# EAGLE design manvnode (EAGLE 5.09)
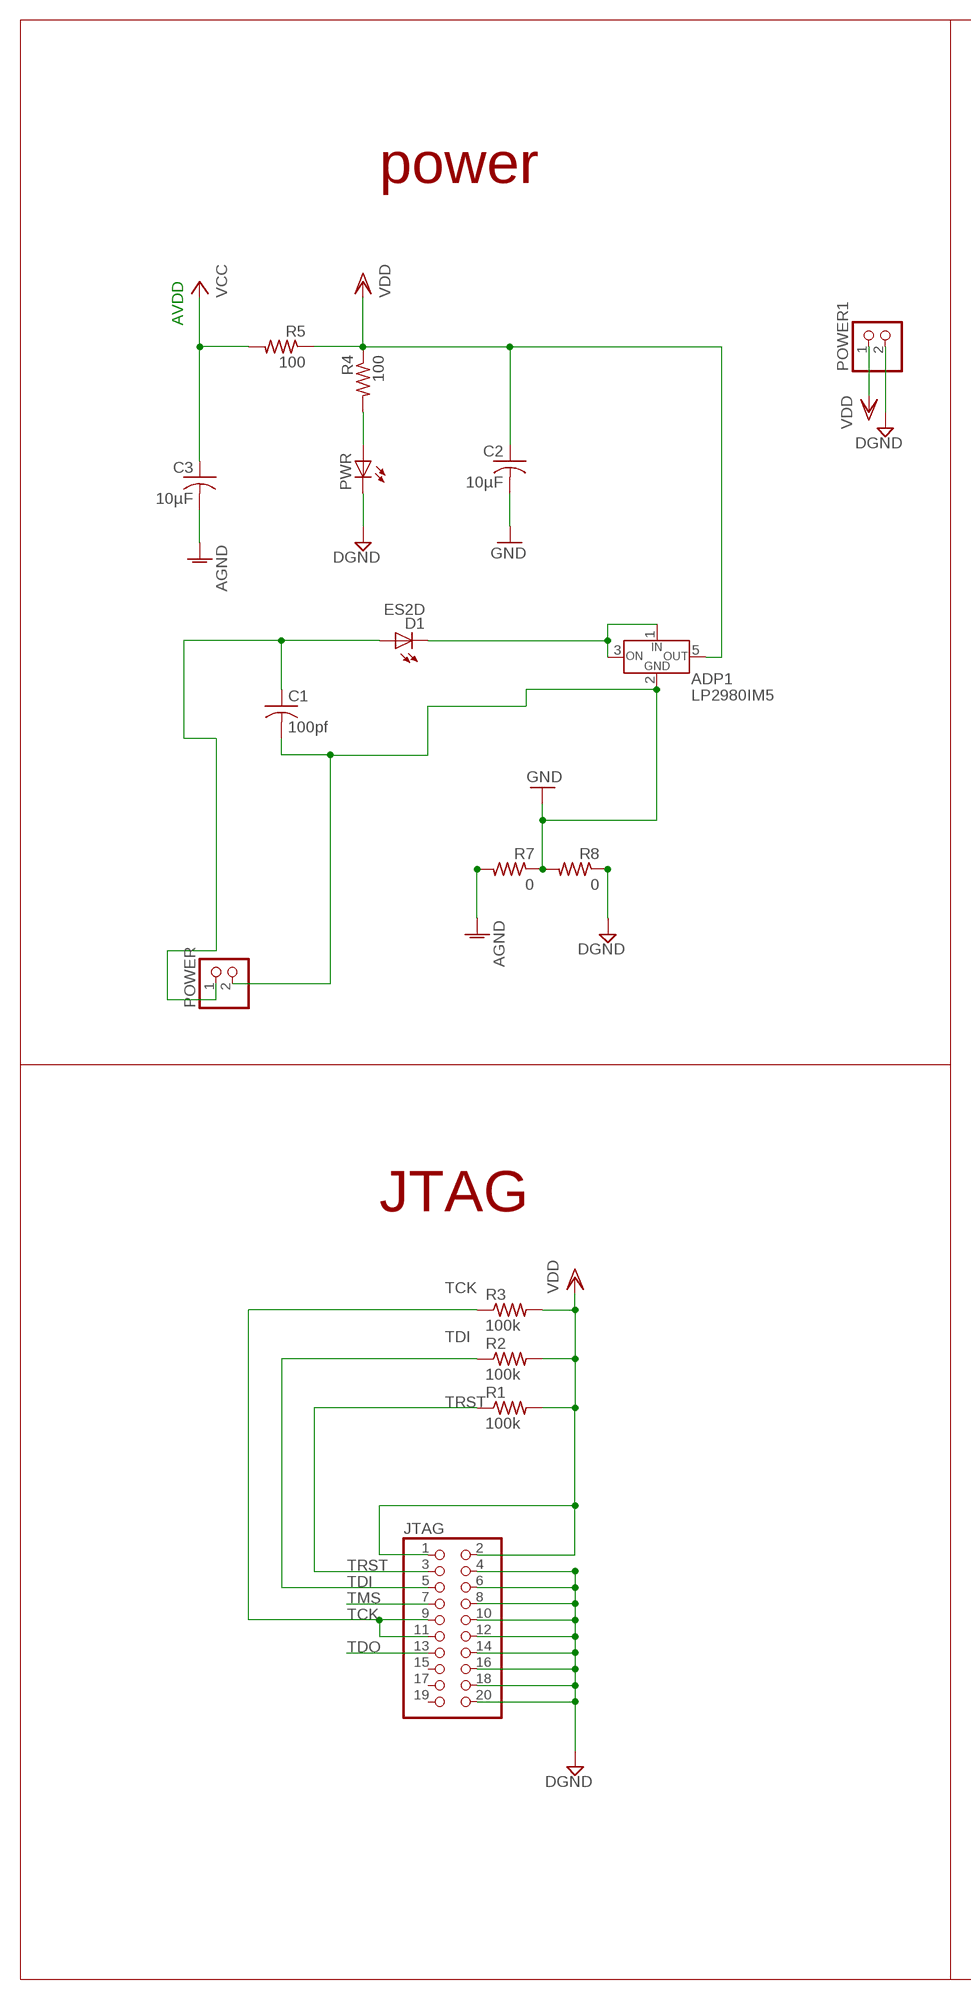
[diagram p0: schematic, sheet 1, part 1 of 2]
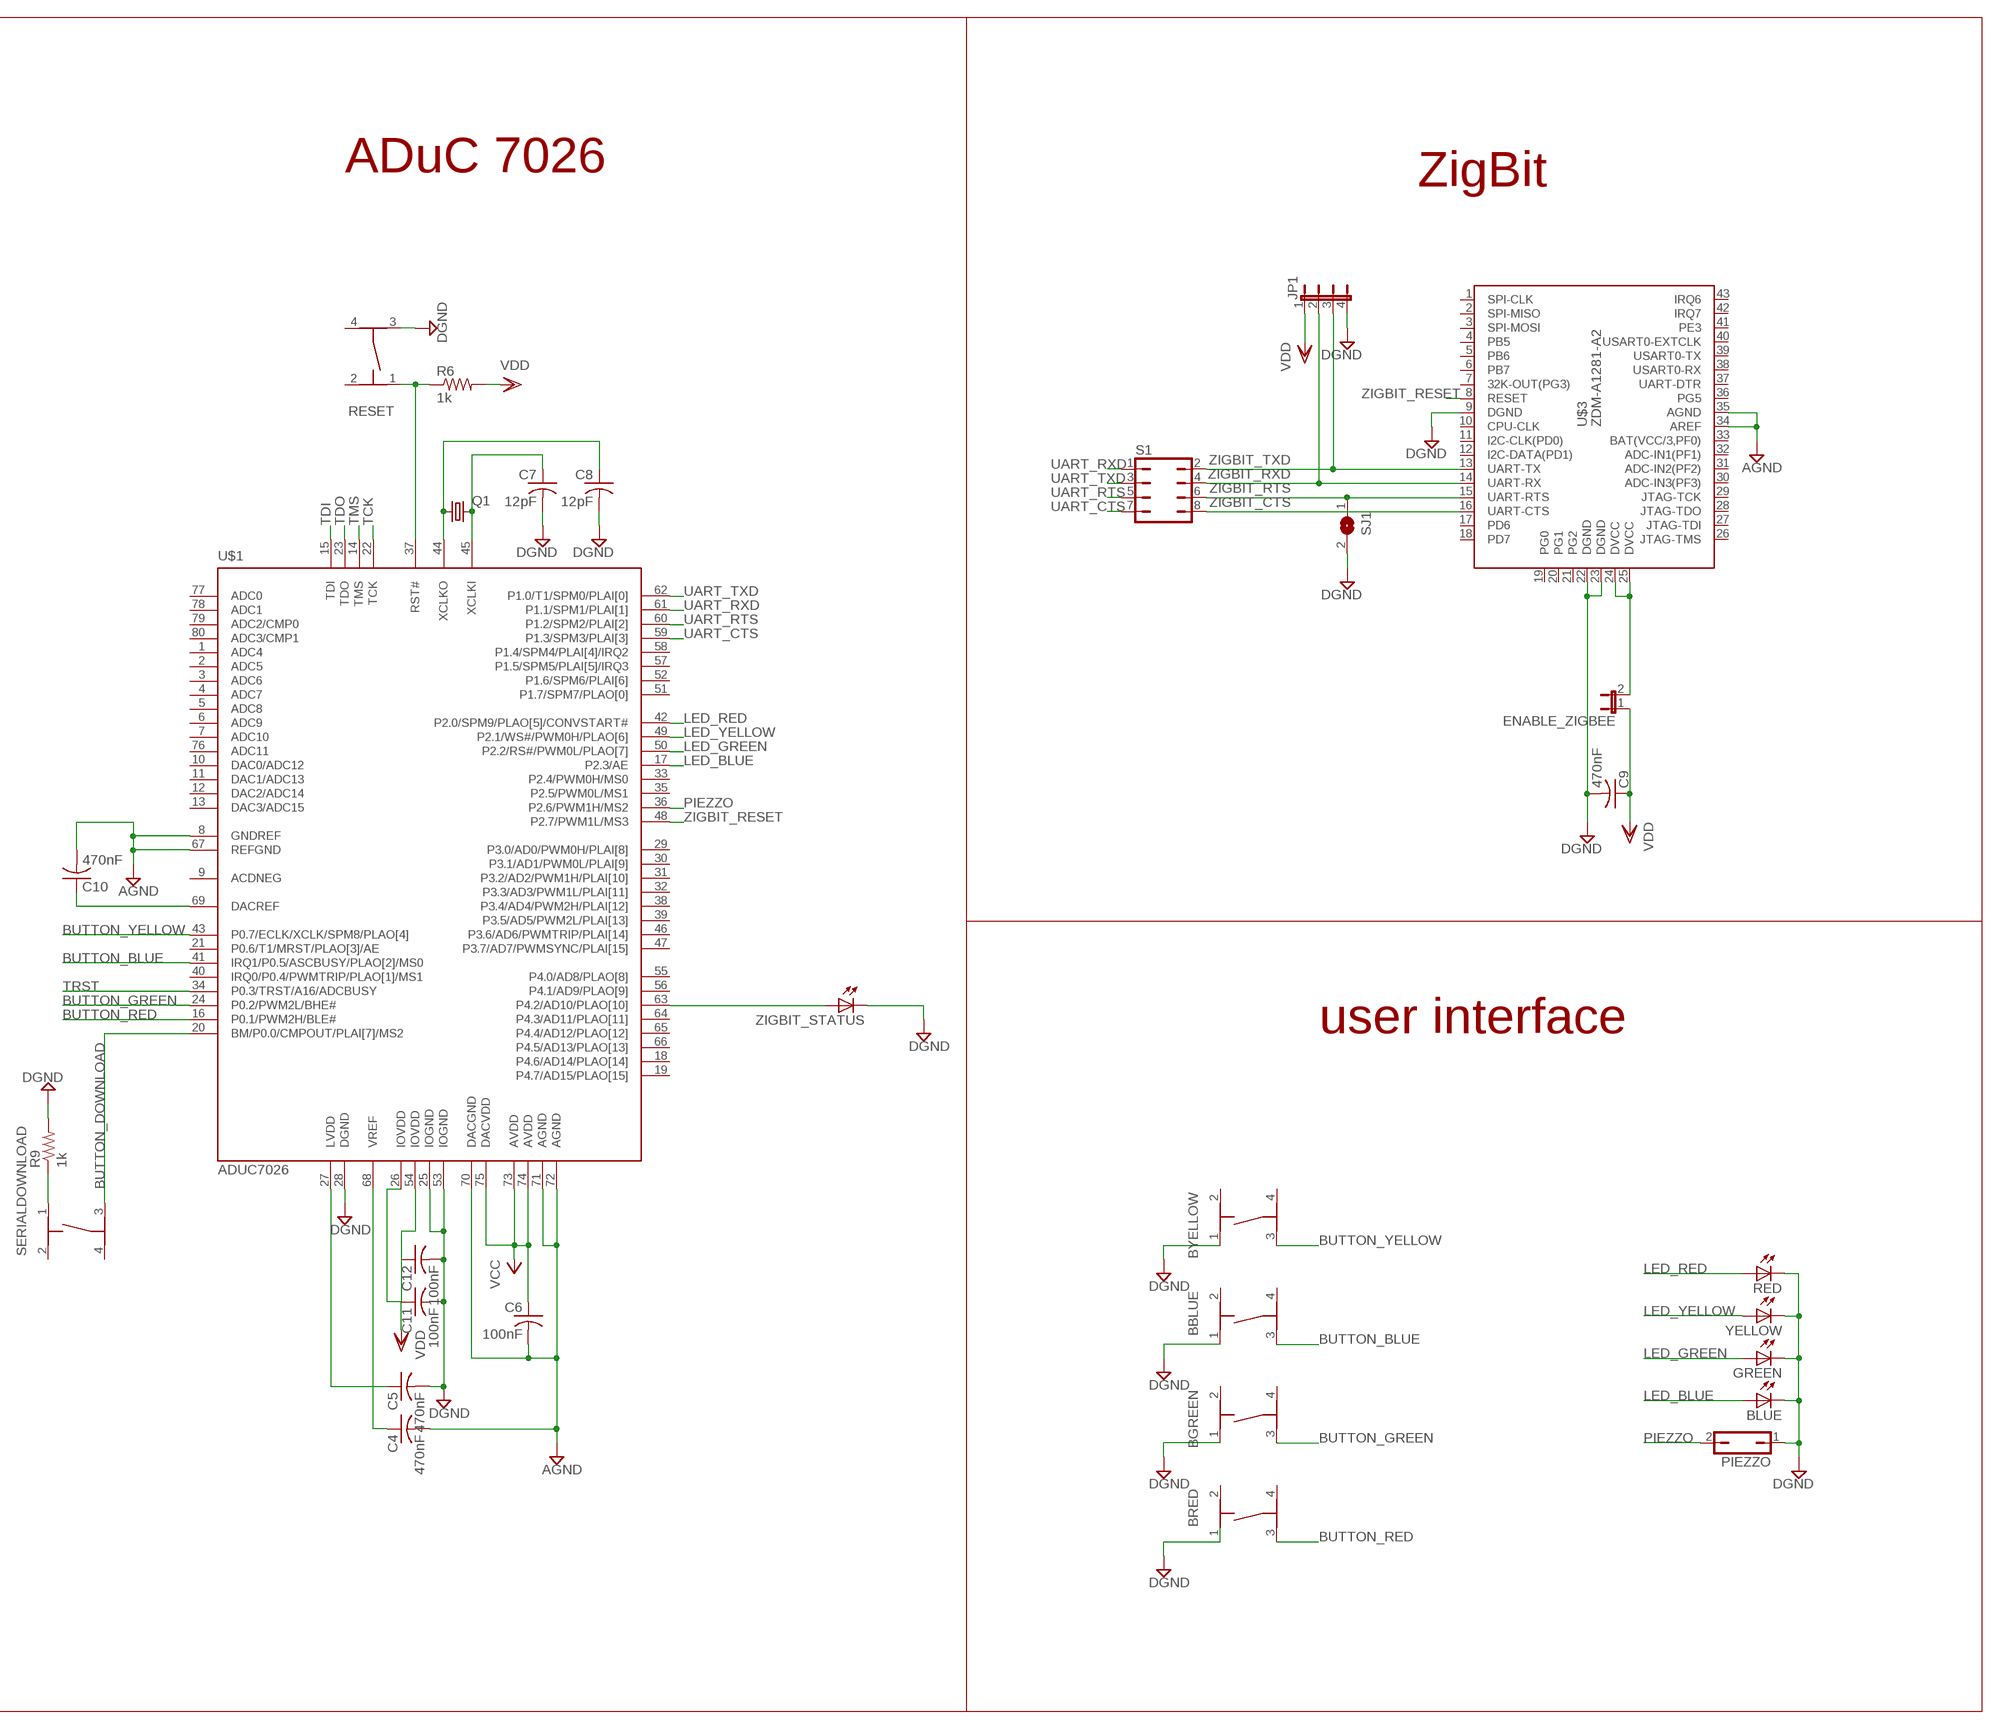
[diagram p1: schematic, sheet 1, part 2 of 2]

## Parts
ADP1  LP2980IM5  [SOT23-5]
BBLUE  TASTER-9314_SMD  [TASTER-9314_SMD]
BGREEN  TASTER-9314_SMD  [TASTER-9314_SMD]
BLUE  LEDCHIP-LED0805  [CHIP-LED0805]
BRED  TASTER-9314_SMD  [TASTER-9314_SMD]
BYELLOW  TASTER-9314_SMD  [TASTER-9314_SMD]
C1  100pf  C-USC0805K  [C0805K]
C2  10µF  C-USC0805K  [C0805K]
C3  10µF  C-USC0805K  [C0805K]
C4  470nF  C-USC0805K  [C0805K]
C5  470nF  C-USC0805K  [C0805K]
C6  100nF  C-USC0805K  [C0805K]
C7  12pF  C-USC0805K  [C0805K]
C8  12pF  C-USC0805K  [C0805K]
C9  470nF  C-USC0805K  [C0805K]
C10  470nF  C-USC0805K  [C0805K]
C11  100nF  C-USC0805K  [C0805K]
C12  100nF  C-USC0805K  [C0805K]
D1  ES2D  LEDCHIPLED_0805  [CHIPLED_0805]
ENABLE_ZIGBEE  JP1E  [JP1]
GREEN  LEDCHIP-LED0805  [CHIP-LED0805]
JP1  JP4E  [JP4]
JTAG  PINHD-2X10  [2X10]
PIEZZO  JP1Q  [JP1]
POWER  PINHD-1X2  [1X02]
POWER1  PINHD-1X2  [1X02]
PWR  LEDCHIP-LED0805  [CHIP-LED0805]
Q1  CRYSTALTC38H  [TC38H]
R1  100k  R-US_R0805  [R0805]
R2  100k  R-US_R0805  [R0805]
R3  100k  R-US_R0805  [R0805]
R4  100  R-US_R0805  [R0805]
R5  100  R-US_R0805  [R0805]
R6  1k  R-US_R0805  [R0805]
R7  0  R-US_R0805  [R0805]
R8  0  R-US_R0805  [R0805]
R9  1k  R-US_R0805  [R0805]
RED  LEDCHIP-LED0805  [CHIP-LED0805]
RESET  TASTER-9314_SMD  [TASTER-9314_SMD]
S1  JP4Q  [JP4Q]
SERIALDOWNLOAD  TASTER-9314_SMD  [TASTER-9314_SMD]
SJ1  SJ  [SJ]
U$1  ADUC7026  [SQFP-S-12X12-80]
U$3  ZDM-A1281-A2  [ZIGBITA2]
YELLOW  LEDCHIP-LED0805  [CHIP-LED0805]
ZIGBIT_STATUS  LEDCHIP-LED0805  [CHIP-LED0805]

## Nets
AGND: C3.2 C4.2 C6.2 C10.2 R7.2 U$1.8(GNDREF) U$1.67(REFGND) U$1.70(DACGND) U$1.71(AGND) U$1.72(AGND) U$3.34(AREF) U$3.35(AGND)
BUTTON_BLUE: BBLUE.3 U$1.41(IRQ1/P0.5/ASCBUSY/PLAO[2]/MS0)
BUTTON_DOWNLOAD: SERIALDOWNLOAD.3 U$1.20(BM/P0.0/CMPOUT/PLAI[7]/MS2)
BUTTON_GREEN: BGREEN.3 U$1.24(P0.2/PWM2L/BHE#)
BUTTON_RED: BRED.3 U$1.16(P0.1/PWM2H/BLE#)
BUTTON_YELLOW: BYELLOW.3 U$1.43(P0.7/ECLK/XCLK/SPM8/PLAO[4])
DGND: BBLUE.1 BGREEN.1 BLUE.C BRED.1 BYELLOW.1 C5.2 C7.2 C8.2 C9.2 C11.2 C12.2 GREEN.C JP1.4 JTAG.4 JTAG.6 JTAG.8 JTAG.10 JTAG.12 JTAG.14 JTAG.16 JTAG.18 JTAG.20 PIEZZO.1 POWER1.2 PWR.C R8.1 R9.2 RED.C RESET.3 SJ1.2 U$1.25(IOGND) U$1.28(DGND) U$1.53(IOGND) U$3.9(DGND) U$3.22(DGND) U$3.23(DGND) YELLOW.C ZIGBIT_STATUS.C
GND: ADP1.2(GND) C1.2 C2.2 POWER.2 R7.1 R8.2
LED_BLUE: BLUE.A U$1.17(P2.3/AE)
LED_GREEN: GREEN.A U$1.50(P2.2/RS#/PWM0L/PLAO[7])
LED_RED: RED.A U$1.42(P2.0/SPM9/PLAO[5]/CONVSTART#)
LED_YELLOW: U$1.49(P2.1/WS#/PWM0H/PLAO[6]) YELLOW.A
N$1: U$1.63(P4.2/AD10/PLAO[10]) ZIGBIT_STATUS.A
N$2: C1.1 D1.A POWER.1
N$7: PWR.A R4.2
N$10: R6.1 RESET.1 U$1.37(RST#)
N$13: R9.1 SERIALDOWNLOAD.1
N$15: C8.1 Q1.1 U$1.44(XCLKO)
N$16: C5.1 U$1.27(LVDD)
N$17: C7.1 Q1.2 U$1.45(XCLKI)
N$25: ADP1.1(IN) ADP1.3(ON/OFF) D1.C
N$26: C10.1 U$1.69(DACREF)
N$27: C4.1 U$1.68(VREF)
N$30: ENABLE_ZIGBEE.2 U$3.24(DVCC) U$3.25(DVCC)
PIEZZO: PIEZZO.2 U$1.36(P2.6/PWM1H/MS2)
TCK: JTAG.9 JTAG.11 R3.1 U$1.22(TCK)
TDI: JTAG.5 R2.1 U$1.15(TDI)
TDO: JTAG.13 U$1.23(TDO)
TMS: JTAG.7 U$1.14(TMS)
TRST: JTAG.3 R1.1 U$1.34(P0.3/TRST/A16/ADCBUSY)
UART_CTS: S1.7 U$1.59(P1.3/SPM3/PLAI[3])
UART_RTS: S1.5 U$1.60(P1.2/SPM2/PLAI[2])
UART_RXD: S1.1 U$1.61(P1.1/SPM1/PLAI[1])
UART_TXD: S1.3 U$1.62(P1.0/T1/SPM0/PLAI[0])
VCC: C3.1 C6.1 R5.2 U$1.73(AVDD) U$1.74(AVDD) U$1.75(DACVDD)
VDD: ADP1.5(OUT) C2.1 C9.1 C11.1 C12.1 ENABLE_ZIGBEE.1 JP1.1 JTAG.1 JTAG.2 POWER1.1 R1.2 R2.2 R3.2 R4.1 R5.1 R6.2 U$1.26(IOVDD) U$1.54(IOVDD)
ZIGBIT_CTS: S1.8 U$3.16(UART-CTS)
ZIGBIT_RESET: U$1.48(P2.7/PWM1L/MS3) U$3.8(RESET)
ZIGBIT_RTS: S1.6 SJ1.1 U$3.15(UART-RTS)
ZIGBIT_RXD: JP1.2 S1.4 U$3.14(UART-RX)
ZIGBIT_TXD: JP1.3 S1.2 U$3.13(UART-TX)
Unconnected: BBLUE.2 BBLUE.4 BGREEN.2 BGREEN.4 BRED.2 BRED.4 BYELLOW.2 BYELLOW.4 JTAG.15 JTAG.17 JTAG.19 RESET.2 RESET.4 SERIALDOWNLOAD.2 SERIALDOWNLOAD.4 U$1.1(ADC4) U$1.2(ADC5) U$1.3(ADC6) U$1.4(ADC7) U$1.5(ADC8) U$1.6(ADC9) U$1.7(ADC10) U$1.9(ACDNEG) U$1.10(DAC0/ADC12) U$1.11(DAC1/ADC13) U$1.12(DAC2/ADC14) U$1.13(DAC3/ADC15) U$1.18(P4.6/AD14/PLAO[14]) U$1.19(P4.7/AD15/PLAO[15]) U$1.21(P0.6/T1/MRST/PLAO[3]/AE) U$1.29(P3.0/AD0/PWM0H/PLAI[8]) U$1.30(P3.1/AD1/PWM0L/PLAI[9]) U$1.31(P3.2/AD2/PWM1H/PLAI[10]) U$1.32(P3.3/AD3/PWM1L/PLAI[11]) U$1.33(P2.4/PWM0H/MS0) U$1.35(P2.5/PWM0L/MS1) U$1.38(P3.4/AD4/PWM2H/PLAI[12]) U$1.39(P3.5/AD5/PWM2L/PLAI[13]) U$1.40(IRQ0/P0.4/PWMTRIP/PLAO[1]/MS1) U$1.46(P3.6/AD6/PWMTRIP/PLAI[14]) U$1.47(P3.7/AD7/PWMSYNC/PLAI[15]) U$1.51(P1.7/SPM7/PLAO[0]) U$1.52(P1.6/SPM6/PLAI[6]) U$1.55(P4.0/AD8/PLAO[8]) U$1.56(P4.1/AD9/PLAO[9]) U$1.57(P1.5/SPM5/PLAI[5]/IRQ3) U$1.58(P1.4/SPM4/PLAI[4]/IRQ2) U$1.64(P4.3/AD11/PLAO[11]) U$1.65(P4.4/AD12/PLAO[12]) U$1.66(P4.5/AD13/PLAO[13]) U$1.76(ADC11) U$1.77(ADC0) U$1.78(ADC1) U$1.79(ADC2/CMP0) U$1.80(ADC3/CMP1) U$3.1(SPI-CLK) U$3.2(SPI-MISO) U$3.3(SPI-MOSI) U$3.4(PB5) U$3.5(PB6) U$3.6(PB7) U$3.7(32K-OUT(PG3)) U$3.10(CPU-CLK) U$3.11(I2C-CLK(PD0)) U$3.12(I2C-DATA(PD1)) U$3.17(PD6) U$3.18(PD7) U$3.19(PG0) U$3.20(PG1) U$3.21(PG2) U$3.26(JTAG-TMS) U$3.27(JTAG-TDI) U$3.28(JTAG-TDO) U$3.29(JTAG-TCK) U$3.30(ADC-IN3(PF3)) U$3.31(ADC-IN2(PF2)) U$3.32(ADC-IN1(PF1)) U$3.33(BAT(VCC/3,PF0)) U$3.36(PG5) U$3.37(UART-DTR) U$3.38(USART0-RX) U$3.39(USART0-TX) U$3.40(USART0-EXTCLK) U$3.41(PE3) U$3.42(IRQ7) U$3.43(IRQ6)

## Notes on the sheet
- power | ADuC 7026
- ZigBit
- AVDD
- JTAG | user interface

## Library data of the parts
ADP1 = linus:LP2980IM5
BBLUE BGREEN BRED BYELLOW RESET SERIALDOWNLOAD = Ergaenzung:TASTER-9314_SMD
BLUE D1 GREEN PWR RED YELLOW ZIGBIT_STATUS = led:LED: LED OSRAM: - CHIPLED LG R971, LG N971, LY N971, LG Q971, LY Q971, LO R971, LY R971 LH N974, LH R974 LS Q976, LO Q976, LY Q976 LO Q996 - Hyper CHIPLED LW Q18S LB Q993, LB Q99A, LB R99A - SideLED LS A670, LO A670, LY A670, LG A670, LP A670 LB A673, LV A673, LT A673, LW A673 LH A674 LY A675 LS A676, LA A676, LO A676, LY A676, LW A676 LS A679, LY A679, LG A679 - Hyper Micro SIDELED® LS Y876, LA Y876, LO Y876, LY Y876 LT Y87S - SmartLED LW L88C, LW L88S LB L89C, LB L89S, LG L890 LS L89K, LO L89K, LY L89K LS L896, LA L896, LO L896, LY L896 - TOPLED LS T670, LO T670, LY T670, LG T670, LP T670 LSG T670, LSP T670, LSY T670, LOP T670, LYG T670 LG T671, LOG T671, LSG T671 LB T673, LV T673, LT T673, LW T673 LH T674 LS T676, LA T676, LO T676, LY T676, LB T676, LH T676, LSB T676, LW T676 LB T67C, LV T67C, LT T67C, LS T67K, LO T67K, LY T67K, LW E67C LS E67B, LA E67B, LO E67B, LY E67B, LB E67C, LV E67C, LT E67C LW T67C LS T679, LY T679, LG T679 LS T770, LO T770, LY T770, LG T770, LP T770 LB T773, LV T773, LT T773, LW T773 LH T774 LS E675, LA E675, LY E675, LS T675 LS T776, LA T776, LO T776, LY T776, LB T776 LHGB T686 LT T68C, LB T68C - Hyper Mini TOPLED® LB M676 - Mini TOPLED Santana® LG M470 LS M47K, LO M47K, LY M47K Source: http://www.osram.convergy.de LUXEON: - LUMILED® LXK2-PW12-R00, LXK2-PW12-S00, LXK2-PW14-U00, LXK2-PW14-V00 LXK2-PM12-R00, LXK2-PM12-S00, LXK2-PM14-U00 LXK2-PE12-Q00, LXK2-PE12-R00, LXK2-PE12-S00, LXK2-PE14-T00, LXK2-PE14-U00 LXK2-PB12-K00, LXK2-PB12-L00, LXK2-PB12-M00, LXK2-PB14-N00, LXK2-PB14-P00, LXK2-PB14-Q00 LXK2-PR12-L00, LXK2-PR12-M00, LXK2-PR14-Q00, LXK2-PR14-R00 LXK2-PD12-Q00, LXK2-PD12-R00, LXK2-PD12-S00 LXK2-PH12-R00, LXK2-PH12-S00 LXK2-PL12-P00, LXK2-PL12-Q00, LXK2-PL12-R00 Source: www.luxeon.com KINGBRIGHT: KA-3528ASYC Source: www.kingbright.com
C1-C12 = resistor:C-US: CAPACITOR, American symbol
ENABLE_ZIGBEE = jumper:JP1E: JUMPER
JP1 = jumper:JP4E: JUMPER
JTAG = pinhead:PINHD-2X10: PIN HEADER
PIEZZO = jumper:JP1Q: JUMPER
POWER POWER1 = pinhead:PINHD-1X2: PIN HEADER
Q1 = crystal:CRYSTAL: CRYSTAL
R1-R9 = resistor:R-US_: RESISTOR, American symbol
S1 = jumper:JP4Q: JUMPER
SJ1 = jumper:SJ: SMD solder JUMPER
U$1 = aduc-arm7:ADUC7026
U$3 = atmel:ZDM-A1281-A2

## Board
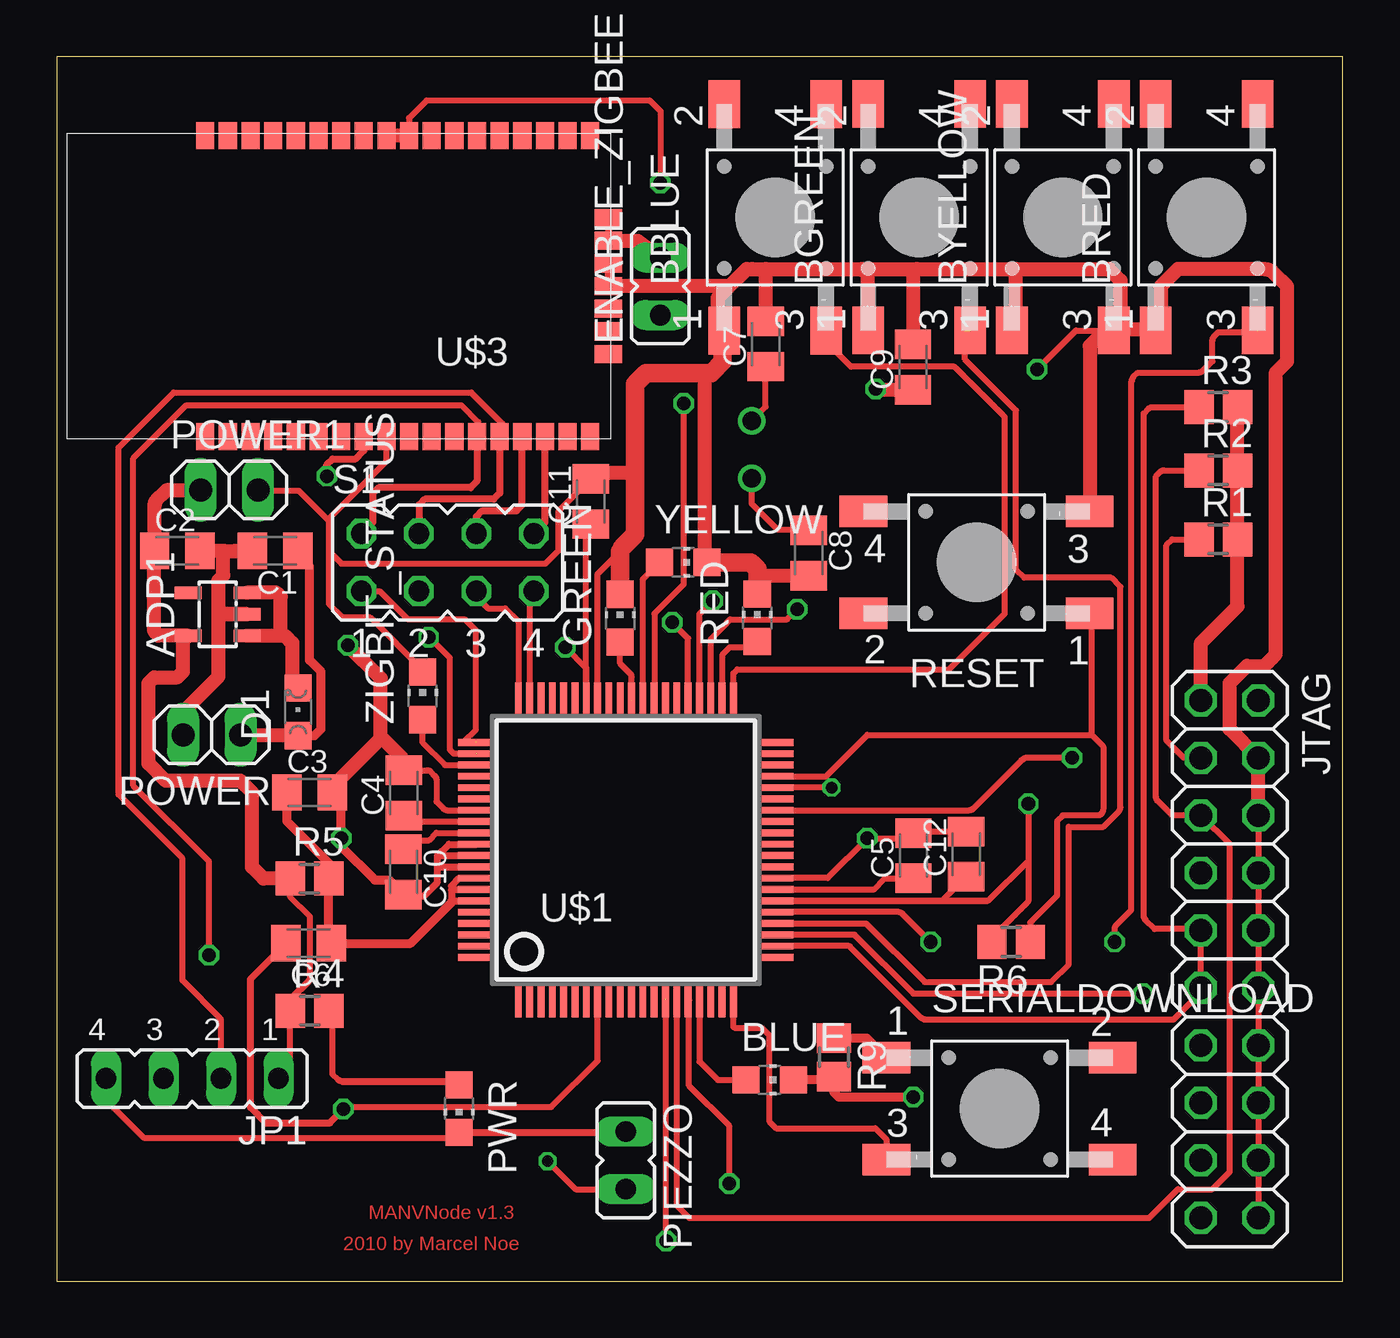
[diagram p2: board, top side]
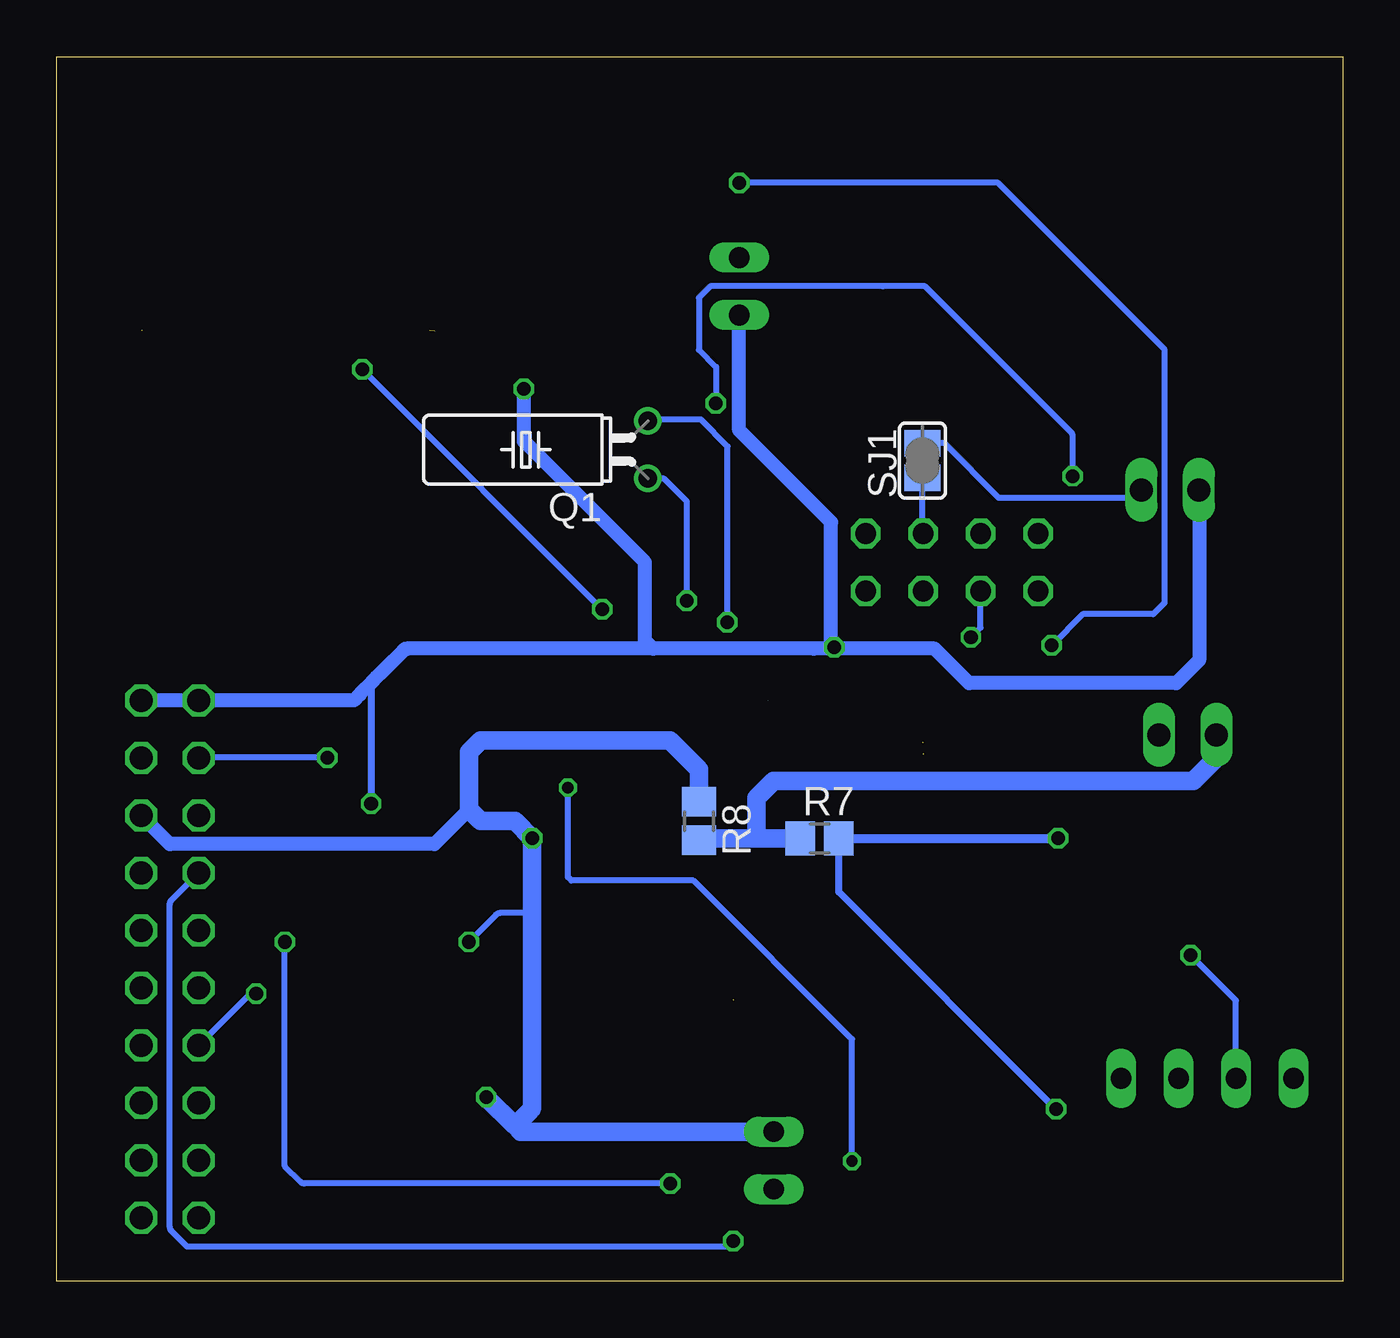
[diagram p3: board, bottom side, seen from below]

Size 56.82 x 54.09 mm. Coordinates in mm from the lower left corner, seen from the top.
Outline: 0,0 56.82,0 56.82,54.09 0,54.09 0,0
Copper layers (1*16): Top 0.035mm / dielectric 1.5mm / Bottom 0.035mm
Design rules "PCB-POOL Standard": minimum track width 0.15mm, minimum drill 0.3mm, track to track 0.15mm, track to pad 0.15mm, pad to pad 0.15mm, via to via 0.15mm, smd to smd 0.15mm, copper to edge 0.3mm, drill to drill 0.2mm, minimum pad ring 0.2mm, minimum via ring 0.15mm, stop-mask expansion 0.075mm, vias tented up to drill 0mil, thermal gap 0.2mm

### Footprints (pad centres in the part's own frame; a part is rotated, then mirrored left to right if it is on the bottom)
SOT23-5 = smd 0.55 x 1.2: 1 -0.95,-1.3; 2 0,-1.3; 3 0.95,-1.3; 4 0.95,1.3; 5 -0.95,1.3
TASTER-9314_SMD = smd 2.1 x 1.4: 1 -5,2.25; 2 5,2.25; 3 -5,-2.25; 4 5,-2.25
CHIP-LED0805 = smd 1.2 x 1.2: A 0,-1.05; C 0,1.05
C0805K = smd 1.3 x 1.6: 1 -1,0; 2 1,0
CHIPLED_0805 = smd 1.2 x 1.2: A 0,-1.05; C 0,1.05
JP1 = drill 0.914 long: 1 0,-1.27; 2 0,1.27
JP4 = drill 0.914 long: 1 -3.81,0; 2 -1.27,0; 3 1.27,0; 4 3.81,0
2X10 = drill 1.016 octagon: 1 -11.43,-1.27; 2 -11.43,1.27; 3 -8.89,-1.27; 4 -8.89,1.27; 5 -6.35,-1.27; 6 -6.35,1.27; 7 -3.81,-1.27; 8 -3.81,1.27; 9 -1.27,-1.27; 10 -1.27,1.27; 11 1.27,-1.27; 12 1.27,1.27; 13 3.81,-1.27; 14 3.81,1.27; 15 6.35,-1.27; 16 6.35,1.27; 17 8.89,-1.27; 18 8.89,1.27; 19 11.43,-1.27; 20 11.43,1.27
1X02 = drill 1.016 long: 1 -1.27,0; 2 1.27,0
TC38H = drill 0.813 round: 1 -1.27,0; 2 1.27,0
R0805 = smd 1.3 x 1.5: 1 -0.85,0; 2 0.85,0
JP4Q = drill 0.914 octagon: 1 -3.81,-1.27; 2 -3.81,1.27; 3 -1.27,-1.27; 4 -1.27,1.27; 5 1.27,-1.27; 6 1.27,1.27; 7 3.81,-1.27; 8 3.81,1.27
SJ = smd 1.168 x 1.6: 1 -0.762,0; 2 0.762,0
SQFP-S-12X12-80 = smd 0.3 x 1.6: 1 -4.75,-6.6; 2 -4.25,-6.6; 3 -3.75,-6.6; 4 -3.25,-6.6; 5 -2.75,-6.6; 6 -2.25,-6.6; 7 -1.75,-6.6; 8 -1.25,-6.6; 9 -0.75,-6.6; 10 -0.25,-6.6; 11 0.25,-6.6; 12 0.75,-6.6; 13 1.25,-6.6; 14 1.75,-6.6; 15 2.25,-6.6; 16 2.75,-6.6; 17 3.25,-6.6; 18 3.75,-6.6; 19 4.25,-6.6; 20 4.75,-6.6; 41 4.75,6.6; 42 4.25,6.6; 43 3.75,6.6; 44 3.25,6.6; 45 2.75,6.6; 46 2.25,6.6; 47 1.75,6.6; 48 1.25,6.6; 49 0.75,6.6; 50 0.25,6.6; 51 -0.25,6.6; 52 -0.75,6.6; 53 -1.25,6.6; 54 -1.75,6.6; 55 -2.25,6.6; 56 -2.75,6.6; 57 -3.25,6.6; 58 -3.75,6.6; 59 -4.25,6.6; 60 -4.75,6.6 | smd 1.6 x 0.3: 21 6.6,-4.75; 22 6.6,-4.25; 23 6.6,-3.75; 24 6.6,-3.25; 25 6.6,-2.75; 26 6.6,-2.25; 27 6.6,-1.75; 28 6.6,-1.25; 29 6.6,-0.75; 30 6.6,-0.25; 31 6.6,0.25; 32 6.6,0.75; 33 6.6,1.25; 34 6.6,1.75; 35 6.6,2.25; 36 6.6,2.75; 37 6.6,3.25; 38 6.6,3.75; 39 6.6,4.25; 40 6.6,4.75; 61 -6.6,4.75; 62 -6.6,4.25; 63 -6.6,3.75; 64 -6.6,3.25; 65 -6.6,2.75; 66 -6.6,2.25; 67 -6.6,1.75; 68 -6.6,1.25; 69 -6.6,0.75; 70 -6.6,0.25; 71 -6.6,-0.25; 72 -6.6,-0.75; 73 -6.6,-1.25; 74 -6.6,-1.75; 75 -6.6,-2.25; 76 -6.6,-2.75; 77 -6.6,-3.25; 78 -6.6,-3.75; 79 -6.6,-4.25; 80 -6.6,-4.75
ZIGBITA2 = smd 0.8 x 1.2: 1 7.4,7.4; 2 6.4,7.4; 3 5.4,7.4; 4 4.4,7.4; 5 3.4,7.4; 6 2.4,7.4; 7 1.4,7.4; 8 0.4,7.4; 9 -0.6,7.4; 10 -1.6,7.4; 11 -2.6,7.4; 12 -3.6,7.4; 13 -4.6,7.4; 14 -5.6,7.4; 15 -6.6,7.4; 16 -7.6,7.4; 17 -8.6,7.4; 18 -9.6,7.4; 26 -9.6,-5.9; 27 -8.6,-5.9; 28 -7.6,-5.9; 29 -6.6,-5.9; 30 -5.6,-5.9; 31 -4.6,-5.9; 32 -3.6,-5.9; 33 -2.6,-5.9; 34 -1.6,-5.9; 35 -0.6,-5.9; 36 0.4,-5.9; 37 1.4,-5.9; 38 2.4,-5.9; 39 3.4,-5.9; 40 4.4,-5.9; 41 5.4,-5.9; 42 6.4,-5.9; 43 7.4,-5.9 | smd 1.2 x 0.8: 19 -10.4,3.75; 20 -10.4,2.75; 21 -10.4,1.75; 22 -10.4,0.75; 23 -10.4,-0.25; 24 -10.4,-1.25; 25 -10.4,-2.25

### Placement (x,y rotation side)
ADP1  7.11,29.46 90 top
BBLUE  31.74,46.99 90 top
BGREEN  38.1,46.99 90 top
BLUE  31.5,8.89 270 top
BRED  50.8,46.99 90 top
BYELLOW  44.45,46.99 90 top
C1  9.65,32.26 180 top
C2  5.33,32.26 0 top
C3  11.18,21.59 0 top
C4  15.34,21.57 90 top
C5  37.85,18.8 90 top
C6  11.14,14.93 180 top
C7  31.32,41.4 90 top
C8  33.22,32.17 270 top
C9  37.83,40.38 90 top
C10  15.32,18.07 270 top
C11  23.6,34.44 90 top
C12  40.17,18.86 90 top
D1  10.67,25.15 0 top
ENABLE_ZIGBEE  26.67,43.94 0 top
GREEN  24.89,29.29 0 top
JP1  5.99,8.95 180 top
JTAG  51.82,14.22 270 top
PIEZZO  25.15,5.33 180 top
POWER  6.86,24.13 180 top
POWER1  7.63,34.95 0 top
PWR  17.78,7.62 180 top
Q1  30.7,36.73 90 bottom
R1  51.31,32.77 0 top
R2  51.31,35.81 0 top
R3  51.31,38.61 0 top
R4  11.19,11.95 0 top
R5  11.18,17.78 0 top
R6  42.16,14.99 180 top
R7  23.11,19.56 0 bottom
R8  28.45,20.32 270 bottom
R9  34.34,9.89 270 top
RED  30.95,29.3 0 top
RESET  40.64,31.75 180 top
S1  17.27,31.75 0 top
SERIALDOWNLOAD  41.66,7.62 0 top
SJ1  18.57,36.25 90 bottom
U$1  25.15,19.05 0 top
U$3  13.97,44.7 180 top
YELLOW  27.69,31.75 270 top
ZIGBIT_STATUS  16.17,25.85 0 top

### Tracks (layer width: path | path; a pad name or v marks a point on that pad's centre or on a via)
AGND  (via drill 0.6)
  Top 0.254: U$1.72 18.03,18.3 18.01,18.29 | 18.55,20.83 U$1.67 17.27,20.8 arc-45 17.09,20.87 16.78,21.18 16.78,22.14 arc45 16.71,22.32 16.52,22.51 arc45 16.38,22.57 C4.2 | 12.45,21.34 12.45,22.1 | 12.45,21.34 12.57,21.21 12.7,21.08 | U$3.34 15.57,51.38 16.34,52.15 26.21,52.15 26.69,51.66 26.69,48.54 v26.67,48.51 | 12.45,21.34 12.19,21.59 C3.2 | 16.82,18.8 16.9,18.8 | 12.77,7.69 21.85,7.69 23.9,9.74 U$1.8
  Top 0.305: U$1.70 17.33,19.3 16.82,18.8 16.82,18.25 | 16.82,18.25 16.82,17.61 16.23,17.02 15.37,17.02 C10.2 | U$1.71 16.9,18.8 | U$1.72 16.88,18.3 16.82,18.25 | C6.2 8.56,13.35 8.56,7.67 9.24,6.99 12.07,6.99 v12.68,7.6 12.77,7.69
  Top 0.406: C10.2 14.68,17.72 14.06,17.72 12.57,19.21 v12.57,19.56 12.57,21.21
  Top 0.61: U$3.34 U$3.35 | C3.2 12.19,21.76 | C4.2 15.26,22.57 15.26,23.1 14.32,24.05 | 14.32,24.05 14.32,23.97 12.45,22.1 | 14.32,24.05 14.32,26.64 v12.87,28.09
  Bottom 0.254: v26.67,48.51 15.24,48.51 7.87,41.15 7.87,29.97 8.38,29.46 11.49,29.46 v12.87,28.09
  Bottom 0.305: R7.2 22.26,17.18 v12.68,7.6
  Bottom 0.406: R7.2 v12.59,19.56 12.57,19.54 v12.57,19.56
BUTTON_BLUE
  Top 0.254: U$1.41 | U$1.41 29.9,26.85 30.07,27.02 39.42,27.02 41.88,29.48 41.88,38.18 39.67,40.39 35.09,40.39 33.99,41.49 BBLUE.3
BUTTON_DOWNLOAD
  Top 0.254: U$1.20 29.9,11.25 29.97,11.18 31.17,11.18 31.5,10.85 31.5,7.04 31.78,6.76 36.17,6.76 36.66,6.27 SERIALDOWNLOAD.3
BUTTON_GREEN  (1 unrouted)
  Top 0.254: U$1.24 35.76,15.8 38.35,13.21 43.94,13.21 44.7,13.97 44.7,20.07 46.23,20.07 46.92,20.75 arc45 46.99,20.93 46.99,30.67 46.58,31.07 42.74,31.07 42.38,31.43 42.38,38.46 40.13,40.71 40.13,41.95 | 40.9,41.44 BGREEN.3
BUTTON_RED  (via drill 0.6)  (1 unrouted)
  Top 0.254: v29.72,4.32 29.72,6.86 27.94,8.64 27.94,12.41 U$1.16 | BRED.3 arc-45 52.86,41.91 51.31,41.91 51.13,41.73 arc45 51.05,41.55 51.05,40.64 50.62,40.21 arc-45 50.44,40.13 47.75,40.13 47.57,39.95 arc45 47.5,39.77 arc45 47.47,39.71 47.47,16.39 46.81,15.73 arc45 46.74,15.55 v46.74,14.99
  Bottom 0.254: v46.74,14.99 46.74,5.08 46.05,4.39 arc-45 45.87,4.32 v29.72,4.32
BUTTON_YELLOW  (via drill 0.6)
  Top 0.254: U$1.43 28.9,28.36 29.59,29.05 29.59,29.07 29.75,29.23 32.27,29.23 v32.72,29.68 | v43.31,40.27 45.03,41.99 BYELLOW.3
  Bottom 0.254: v32.72,29.68 | v32.72,29.68 v43.31,40.27
DGND  (via drill 0.6)
  Top 0.254: 31.77,17.78 U$1.28 34.06,17.8 v35.81,19.56 37.5,19.56 arc45 37.68,19.63 C5.2 37.91,19.86 C12.2 | U$1.53 23.88,25.67 23.88,31.2 24.89,32.22 24.97,32.22 24.97,32.4 | 29.46,42.67 29.21,42.42 29.21,42.03 | 29.97,44.2 30.23,44.2 30.73,44.7 | 53.09,20.32 JTAG.6 JTAG.8 JTAG.10 JTAG.12 JTAG.14 JTAG.16 JTAG.18 JTAG.20 | U$1.25 37.19,16.3 arc-45 37.37,16.23 v38.61,14.99 | JP1.4 2.18,7.99 3.84,6.33 17.54,6.33 PWR.C | C11.2 22.18,34.02 22.18,32.27 21.6,31.69 12.58,31.69 12.07,32.2 12.03,32.2 | 12.03,33.58 10.71,34.9 8.95,34.9 POWER1.2 | 12.03,33.58 12.03,33.68 14.58,36.23 14.58,37.29 U$3.9 | 12.03,32.2 12.03,29.92 12.65,29.3 13.86,29.3 16.17,27 ZIGBIT_STATUS.C | 12.03,32.2 12.03,33.58
  Top 0.305: U$3.22 U$3.23 | PWR.C 25.11,6.57 PIEZZO.1
  Top 0.406: C5.2 37.61,19.56 | 48.77,42.03 BRED.1 | BLUE.C 34.19,8.89 R9.2 34.34,8.33 34.55,8.12 v37.84,8.12 v37.85,8.13
  Top 0.61: U$3.9 14.48,37.21 | 31.32,44.7 30.73,44.7 30.48,44.7 29.97,44.2 29.73,43.95 | 35.56,44.7 35.81,44.45 35.81,42.03 BGREEN.1 | 38,44.7 42.36,44.7 | 42.36,44.7 46.48,44.7 46.99,44.2 46.99,42.67 | 35.56,44.7 38,44.7 | 46.99,42.67 46.99,42.03 48.51,42.03 BRED.1 | RESET.3 45.64,41.32 46.99,42.67 | 48.77,42.03 48.77,43.94 49.53,44.7 53.34,44.7 arc-45 53.77,44.52 54.36,43.94 54.36,40.64 53.92,40.21 arc45 53.85,40.03 53.85,27.69 53.34,27.18 52.58,27.18 51.82,26.42 51.82,24.38 JTAG.4 JTAG.6 | 24.89,31.7 arc45 24.77,31.75 | YELLOW.C 28.62,31.86 28.62,40.12 | C8.2 31.15,31.17 30.57,31.75 | 31.32,44.7 C7.2 | 31.32,44.7 35.56,44.7 | C9.2 37.83,44.53 38,44.7 | C11.2 arc-90 23.87,35.71 25.55,35.71 | 29.46,42.67 29.21,42.93 29.21,43.43 29.73,43.95 | 29.73,43.95 U$3.22 | BYELLOW.1 42.36,42.15 42.36,44.7
  Top 0.813: 29.21,42.03 BBLUE.1 29.42,41.92 29.42,40.62 28.92,40.12 28.62,40.12 26.04,40.12 25.55,39.63 25.55,35.71 25.55,32.98 24.97,32.4 | YELLOW.C 30.57,31.75 arc-45 30.74,31.68 30.96,31.46 30.96,30.36 arc45 RED.C | 24.89,32.22 24.89,31.7 GREEN.C
  Bottom 0.254: 35.81,16.26 37.23,16.26 arc-45 37.41,16.18 v38.61,14.99 | 34.89,23.88 34.69,24.08 | SJ1.2 17.61,37.01 15.2,34.6 9.25,34.6 POWER1.2
  Bottom 0.61: JTAG.6 51.82,19.3 40.13,19.3 38.61,20.83
  Bottom 0.813: PIEZZO.1 36.32,6.6 36.58,6.86 | R8.1 28.45,22.61 29.72,23.88 34.89,23.88 38.1,23.88 38.61,23.37 38.61,20.83 38.1,20.32 36.58,20.32 v35.81,19.56 35.81,16.26 35.81,7.73 arc45 35.89,7.55 36.58,6.86 | 36.58,6.86 v37.85,8.13
GND
  Top 0.61: 7.38,32.26 C2.2 | 7.38,32.26 C1.2 7.87,32.26 | POWER.2 5.59,25.15 7.16,26.71 7.16,29.66 7.35,29.46 7.37,29.46 | 7.37,29.46 ADP1.2 arc-45 ADP1.2 7.38,29.46 | 7.38,32.26 arc45 7.37,32.22 7.37,31.17 7.16,30.96 7.16,29.67 7.37,29.46
  Bottom 0.813: 25.91,19.56 R7.1 | 25.91,19.56 25.91,21.34 25.15,22.1 6.6,22.1 5.59,23.11 POWER.2 | 25.91,19.56 28.36,19.56 R8.2
LED_BLUE
  Top 0.254: BLUE.A 29.21,8.89 28.4,9.7 U$1.17
LED_GREEN  (1 unrouted)
  Top 0.254: GREEN.A 24.89,27.28 25.33,26.85 arc-45 25.4,26.67 U$1.50
LED_RED
  Top 0.254: RED.A 30.83,28.07 arc-45 30.65,28 29.73,28 29.47,27.74 arc45 29.4,27.56 U$1.42
  Top 0.305: RED.A 31.28,27.94
LED_YELLOW
  Top 0.254: U$1.49 25.9,31.01 YELLOW.A
N$1
  Top 0.254: U$1.63 17.15,22.8 16.17,23.78 ZIGBIT_STATUS.A
N$2
  Top 0.406: D1.A 11.4,24.1 11.68,24.38 11.68,26.92 11.18,27.43 11.18,31.58 C1.1
  Top 0.61: POWER.1 10.63,24.13 D1.A
N$7
  Top 0.254: PWR.A arc90 17.62,8.84 12.61,8.84 arc-45 12.43,8.91 12.19,9.14 12.19,11.79 R4.2 | PWR.A | PWR.A 17.64,8.81 12.59,8.81 12.57,8.83
N$10
  Top 0.254: 45.72,24.13 46.23,23.62 46.23,20.83 arc-90 45.97,20.57 44.45,20.57 44.2,20.32 44.2,17.02 43.01,15.84 R6.1 | U$1.37 33.98,22.3 35.81,24.13 45.72,24.13 | 45.72,24.13 45.72,29.42 RESET.1
N$13
  Top 0.406: SERIALDOWNLOAD.1 35.78,10.74 R9.1
N$15  (via drill 0.6)
  Top 0.254: Q1.1 30.7,34.34 31.84,33.19 33.19,33.19 C8.1 | U$1.44 28.4,29.47 v28.98,30.05
  Bottom 0.254: v28.98,30.05 28.98,34.44 29.98,35.45 30.68,35.45 Q1.1
N$16
  Top 0.254: U$1.27 36.1,17.3 36.58,17.78 37.83,17.78 C5.1
N$17  (via drill 0.6)
  Top 0.254: U$1.45 27.9,28.39 v27.19,29.1 | 31.32,39.98 C7.1 31.32,38.63 Q1.2
  Bottom 0.254: v27.19,29.1 27.19,29.13 27.17,29.15 27.17,36.87 28.36,38.06 30.64,38.06 Q1.2
N$25
  Top 0.61: ADP1.1 9.91,28.51 | 9.91,28.51 10.09,28.51 10.41,28.19 10.41,26.45 D1.C | ADP1.3 9.72,30.41 9.91,30.23 9.91,28.51
N$26
  Top 0.254: U$1.69 16.77,19.8 16.44,19.48 15.72,19.48 C10.1
N$27
  Top 0.254: C4.1 15.6,20.3 U$1.68
N$30
  Top 0.305: U$3.25 U$3.24
  Top 0.61: U$3.24 25.67,45.95 ENABLE_ZIGBEE.2
PIEZZO  (via drill 0.5)
  Top 0.254: PIEZZO.2 22.92,4.06 v21.69,5.3 | v34.24,21.8 U$1.36
  Bottom 0.254: v34.24,21.8 34.24,17.85 34.08,17.69 28.69,17.69 21.69,10.69 v21.69,5.3
TCK
  Top 0.254: R3.1 48.41,38.61 arc45 48.23,38.53 48.02,38.33 48.02,16.14 arc45 48.09,15.96 48.5,15.55 50.4,15.55 arc-45 JTAG.9 JTAG.11 50.55,12.86 arc-45 50.47,12.68 49.35,11.56 38.36,11.56 arc-45 38.18,11.64 35.05,14.77 arc45 34.98,14.8 U$1.22
TDI
  Top 0.254: R2.1 48.92,35.81 arc45 48.74,35.74 48.56,35.56 48.56,21.39 arc45 48.64,21.21 49.28,20.57 JTAG.5 51.82,19.3 51.82,4.83 51.05,4.06 49.53,4.06 48.26,2.79 27.94,2.79 27.4,3.34 U$1.15
TDO  (via drill 0.6)
  Top 0.254: v48.01,12.7 37.85,12.7 35.25,15.3 U$1.23
  Bottom 0.254: v48.01,12.7 48.16,12.7 arc-45 48.33,12.63 JTAG.13
TMS  (via drill 0.6)  (1 unrouted)
  Top 0.254: v26.92,1.78 26.92,12.42
  Bottom 0.254: v26.92,1.78 27.18,1.52 51.05,1.52 51.74,2.21 arc45 51.82,2.39 51.82,16.66 arc45 51.74,16.84 JTAG.7
TRST  (via drill 0.6)
  Top 0.254: JTAG.3 49.78,23.11 49.02,23.88 49.02,32.51 49.28,32.77 R1.1 | v44.86,23.12 42.86,23.12 arc45 42.68,23.05 42.65,23.02 arc45 42.62,23 40.49,20.87 arc-45 40.31,20.8 U$1.34
  Bottom 0.254: v44.86,23.12 50.52,23.12 arc-45 JTAG.3
UART_CTS
  Top 0.254: S1.7 20.9,30.29 U$1.59
UART_RTS
  Top 0.254: S1.5 18.54,30.23 19.05,29.72 19.81,29.72 20.4,29.13 U$1.60
UART_RXD  (1 unrouted)
  Top 0.254: S1.1 14.27,30.48 15.51,29.24 18.02,29.24 18.52,28.73 18.52,24.35 17.99,23.81 18.51,23.81 18.52,23.82
UART_TXD  (via drill 0.6)  (1 unrouted)
  Top 0.254: v16.43,28.43 16.47,28.43 17.37,27.53 17.37,23.47 17.55,23.29 U$1.62
  Bottom 0.254: S1.3 16,28.87 v16.43,28.43
VCC
  Top 0.254: R5.2 12.51,17.3 | 17.44,16.74 17.44,17.45
  Top 0.305: U$1.73 17.79,17.8 17.44,17.45 17.44,17.26 | 17.44,17.26 17.44,16.75 17.49,16.8 U$1.75 | U$1.74 17.48,17.3 17.44,17.26
  Top 0.406: C3.1 10.18,20.31 12.03,18.46 R5.2 12.03,15.04 C6.1 15.63,14.93 17.44,16.74
VDD  (via drill 0.6)
  Top 0.254: 40.89,15.33 R6.2 41.31,15.05 arc-45 41.39,15.23 42.93,16.76 42.93,18.57 | JP1.1 10.33,9.48 10.33,11.93 R4.1 | C11.1 23.4,33.24 U$1.54 23.4,27.09 v22.48,28 | U$1.26 39.11,16.8 C12.1 | U$1.26 41.15,16.8 41.86,17.51 | U$1.26 41.15,16.8 42.92,18.57 42.93,18.57 | v42.93,21.08 42.93,18.57 | 11.15,13.27 11.2,13.32 11.2,16.1 10.33,16.97 R5.1
  Top 0.305: ADP1.5 5.84,28.48 | 11.15,13.27 10.34,12.46 R4.1
  Top 0.61: R5.1 9.14,17.78 8.64,18.29 8.64,21.59 8.13,22.1 4.83,22.1 4.06,22.86 4.06,26.42 4.32,26.67 5.33,26.67 5.59,26.92 5.59,28.29 ADP1.5 4.51,28.51 4.32,28.7 4.32,32.09 C2.1 4.33,34.31 arc-45 4.41,34.49 4.79,34.87 arc-45 4.97,34.95 POWER1.1 | R3.2 R2.2 R1.2 52.16,29.81 50.55,28.19 JTAG.1 | C9.1 36.22,39.38 v36.18,39.42
  Bottom 0.254: 22.66,28 v22.48,28 | 22.66,28 22.78,28.12 | 42.56,26.81 42.83,26.81 42.83,26.53 | 22.66,28 23.38,28 23.38,27.94
  Bottom 0.305: v42.93,21.08 42.93,26.44 42.86,26.5
  Bottom 0.406: 42.86,26.5 42.93,26.42
  Bottom 0.61: ENABLE_ZIGBEE.1 26.67,37.59 22.61,33.53 22.61,28.2 | 41.93,27.43 42.83,26.53 42.86,26.5 43.43,25.93 43.43,25.91 43.69,25.65 JTAG.1 JTAG.2 | 22.61,28.2 22.61,27.94 23.38,27.94 30.47,27.94 | 30.47,27.94 41.32,27.94 arc-45 41.5,27.87 42.56,26.81 | 6.35,33.82 6.35,34.92 arc-45 POWER1.1 | 6.35,33.82 6.35,27.43 7.37,26.42 16.51,26.42 18.03,27.94 22.35,27.94 22.61,28.2 | 6.35,33.82 arc-45 6.36,33.84 | v36.18,39.42 36.18,37.11 30.84,31.76 30.84,28.3 30.47,27.94
ZIGBIT_CTS
  Top 0.305: U$3.16 21.57,33.51 S1.8
ZIGBIT_RESET  (via drill 0.6)
  Top 0.254: v27.7,38.78 27.7,30.78 26.41,29.49 26.41,25.66 U$1.48 | 13.57,36.68 U$3.8
  Top 0.305: 13.57,36.68 13.21,36.32 12.19,36.32 11.94,36.07 v11.94,35.56
  Bottom 0.254: v11.94,35.56 11.94,37.32 arc-45 12.01,37.5 18.46,43.95 20.3,43.95 arc-45 20.32,43.94 27.94,43.94 28.45,43.43 28.45,41.15 27.69,40.39 v27.69,38.79 v27.7,38.78
ZIGBIT_RTS
  Top 0.305: U$3.15 20.57,34.29 20.32,34.04 18.8,34.04 18.54,33.78 S1.6
  Bottom 0.254: SJ1.1 18.57,33.05 S1.6
ZIGBIT_RXD
  Top 0.254: JP1.2 7.26,11.57 5.56,13.28 5.56,18.67 2.74,21.49 2.74,36.83 5.17,39.26 18.32,39.26 19.71,37.87 19.71,37.44 U$3.14
  Top 0.305: S1.4 16,34.29 16.26,34.54 19.3,34.54 19.57,34.81 U$3.14
ZIGBIT_TXD  (via drill 0.6)
  Top 0.254: v6.73,14.41 6.73,18.54 3.39,21.88 3.39,36.35 5.73,38.69 17.88,38.69 18.62,37.95 18.62,37.36 U$3.13
  Top 0.305: U$3.13 18.57,35.33 18.29,35.05 14.22,35.05 13.97,34.8 13.97,33.53 S1.2
  Bottom 0.254: JP1.3 4.72,12.4 v6.73,14.41

### Text on the board
Top: MANVNode v1.3 | 2010 by Marcel Noe